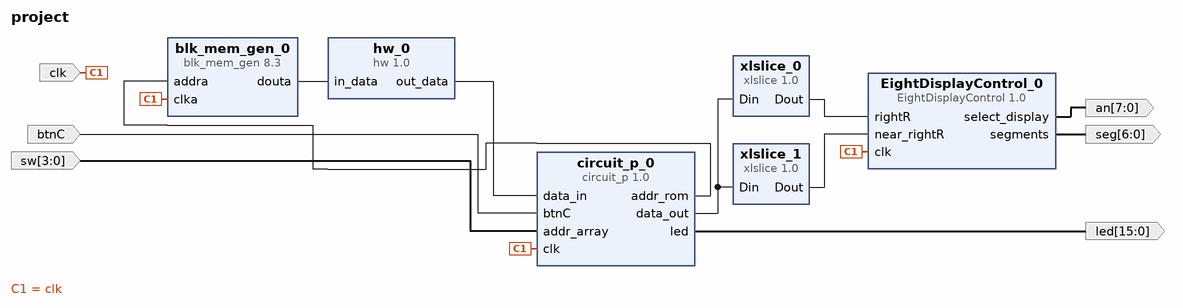
[diagram p0: block diagram of the top level]
# Vivado block design project, Vivado 2015.4
create_bd_design project

create_bd_port -dir I clk
create_bd_port -dir I btnC
create_bd_port -dir I -from 3 -to 0 sw
create_bd_port -dir O -from 15 -to 0 led
create_bd_port -dir O -from 6 -to 0 seg
create_bd_port -dir O -from 7 -to 0 an

create_bd_cell -type ip -vlnv xilinx.com:ip:blk_mem_gen:8.3 blk_mem_gen_0
set_property -dict [list \
  CONFIG.Memory_Type Single_Port_ROM \
  CONFIG.Enable_32bit_Address false \
  CONFIG.Write_Depth_A 16 \
  CONFIG.Enable_A Always_Enabled \
  CONFIG.Register_PortA_Output_of_Memory_Primitives false \
  CONFIG.Load_Init_File true \
  CONFIG.Coe_File ../../../../../../../../../Memoria/16words_32bits_1.coe \
  CONFIG.Use_RSTA_Pin false \
  CONFIG.Port_A_Write_Rate 0 \
  CONFIG.use_bram_block Stand_Alone \
] [get_bd_cells blk_mem_gen_0]
create_bd_cell -type ip -vlnv ua.pt:user:EightDisplayControl:1.0 EightDisplayControl_0
create_bd_cell -type ip -vlnv xilinx.com:ip:xlslice:1.0 xlslice_0
set_property -dict {CONFIG.DOUT_WIDTH 4 CONFIG.DIN_TO 0 CONFIG.DIN_FROM 3 CONFIG.DIN_WIDTH 8} [get_bd_cells xlslice_0]
create_bd_cell -type ip -vlnv xilinx.com:ip:xlslice:1.0 xlslice_1
set_property -dict {CONFIG.DOUT_WIDTH 4 CONFIG.DIN_TO 4 CONFIG.DIN_FROM 7 CONFIG.DIN_WIDTH 8} [get_bd_cells xlslice_1]
create_bd_cell -type ip -vlnv user.org:user:hw:1.0 hw_0
set_property -dict {CONFIG.sw_len 32 CONFIG.out_len 8} [get_bd_cells hw_0]
create_bd_cell -type ip -vlnv user.org:user:circuit_p:1.0 circuit_p_0
set_property -dict {CONFIG.data_width 8} [get_bd_cells circuit_p_0]

# ---- connections ----

connect_bd_net [get_bd_ports clk] [get_bd_pins blk_mem_gen_0/clka] [get_bd_pins EightDisplayControl_0/clk] [get_bd_pins circuit_p_0/clk]
connect_bd_net [get_bd_ports btnC] [get_bd_pins circuit_p_0/btnC]
connect_bd_net [get_bd_pins circuit_p_0/addr_rom] [get_bd_pins blk_mem_gen_0/addra]
connect_bd_net [get_bd_ports sw] [get_bd_pins circuit_p_0/addr_array]
connect_bd_net [get_bd_pins circuit_p_0/led] [get_bd_ports led]
connect_bd_net [get_bd_pins EightDisplayControl_0/segments] [get_bd_ports seg]
connect_bd_net [get_bd_pins EightDisplayControl_0/select_display] [get_bd_ports an]
connect_bd_net [get_bd_pins circuit_p_0/data_out] [get_bd_pins xlslice_0/Din] [get_bd_pins xlslice_1/Din]
connect_bd_net [get_bd_pins xlslice_0/Dout] [get_bd_pins EightDisplayControl_0/rightR]
connect_bd_net [get_bd_pins xlslice_1/Dout] [get_bd_pins EightDisplayControl_0/near_rightR]
connect_bd_net [get_bd_pins blk_mem_gen_0/douta] [get_bd_pins hw_0/in_data]
connect_bd_net [get_bd_pins hw_0/out_data] [get_bd_pins circuit_p_0/data_in]

validate_bd_design
save_bd_design
